# Altium schematic sheet 4_USB-HS.SchDoc
size A4; SheetNumber: 4; SheetTotal: 7
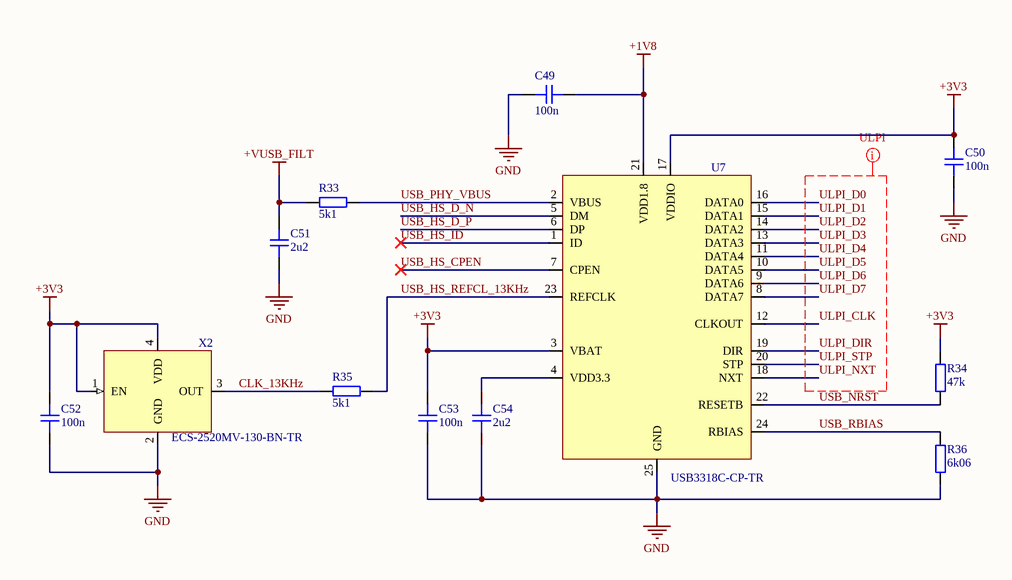
[diagram p0: 4_USB-HS.SchDoc]

## Parts
C49  100n  [CAP_0201]
C50  100n  [CAP_0201]
C51  2u2  [CAP_0201]
C52  100n  [CAP_0201]
C53  100n  [CAP_0201]
C54  2u2  [CAP_0201]
R33  5k1  [RES_0402]
R34  47k  [RES_0402]
R35  5k1  [RES_0402]
R36  6k06  [RES_0402]
U7  USB3318C-CP-TR  [USB3318C-CP-TR]
X2  ECS-2520MV-130-BN-TR  [XTAL_2520]

## Nets
+1V8: C49.2 U7.21(VDD1.8)
+3V3: C50.2 C52.2 C53.2 R34.2 U7.3(VBAT) U7.17(VDDIO) X2.1(EN) X2.4(VDD)
+VUSB_FILT: C51.2 R33.2
GND: C49.1 C50.1 C51.1 C52.1 C53.1 C54.1 R36.1 U7.25(GND) X2.2(GND)
CLK_13KHz: R35.2 X2.3(OUT)
ULPI_CLK: U7.12(CLKOUT)
ULPI_D0: U7.16(DATA0)
ULPI_D1: U7.15(DATA1)
ULPI_D2: U7.14(DATA2)
ULPI_D3: U7.13(DATA3)
ULPI_D4: U7.11(DATA4)
ULPI_D5: U7.10(DATA5)
ULPI_D6: U7.9(DATA6)
ULPI_D7: U7.8(DATA7)
ULPI_DIR: U7.19(DIR)
ULPI_NXT: U7.18(NXT)
ULPI_STP: U7.20(STP)
USB_HS_CPEN: U7.7(CPEN)
USB_HS_D_N: U7.5(DM)
USB_HS_D_P: U7.6(DP)
USB_HS_ID: U7.1(ID)
USB_HS_REFCL_13KHz: R35.1 U7.23(REFCLK)
USB_NRST: R34.1 U7.22(RESETB)
USB_PHY_VBUS: R33.1 U7.2(VBUS)
USB_RBIAS: R36.2 U7.24(RBIAS)
NetC54_2: C54.2 U7.4(VDD3.3)

## Layout directives
net class ULPI: ULPI_CLK, ULPI_D0, ULPI_D1, ULPI_D2, ULPI_D3, ULPI_D4, ULPI_D5, ULPI_D6, ULPI_D7, ULPI_DIR, ULPI_NXT, ULPI_STP

## Library data of the parts
C49-C54 = CAP_0201: Capacitor SMD 0201; Manufacturer: *; Manufacturer Part Number: *; Distributor Link: *; LCSC: *; Rating: *; Dielectric: *
R33-R36 = RES_0402: Resistor SMD 0402; Manufacturer: *; Manufacturer Part Number: *; Distributor Link: *; LCSC: *
U7 = USB3318C-CP-TR: USB Interface IC High Speed USB 1.8V ULPI; Manufacturer: Microchip; Manufacturer Part Number: USB3318C-CP-TR
X2 = ECS-2520MV-130-BN-TR: Standard Clock Oscillators XO (Standard),13MHz,Standby (Power Down),CMOS, Multi-Volt,1.6 V 3.6 V,+/-50ppm,-40 C 85 C,6mA,Surface Mount,4-SMD, No Lead,(2.50mm x 2.00mm),(0.80mm); Manufacturer: ECS; Manufacturer Part Number: ECS-2520MV-130-BN-TR